# Altium schematic sheet STM32.SchDoc
size A4
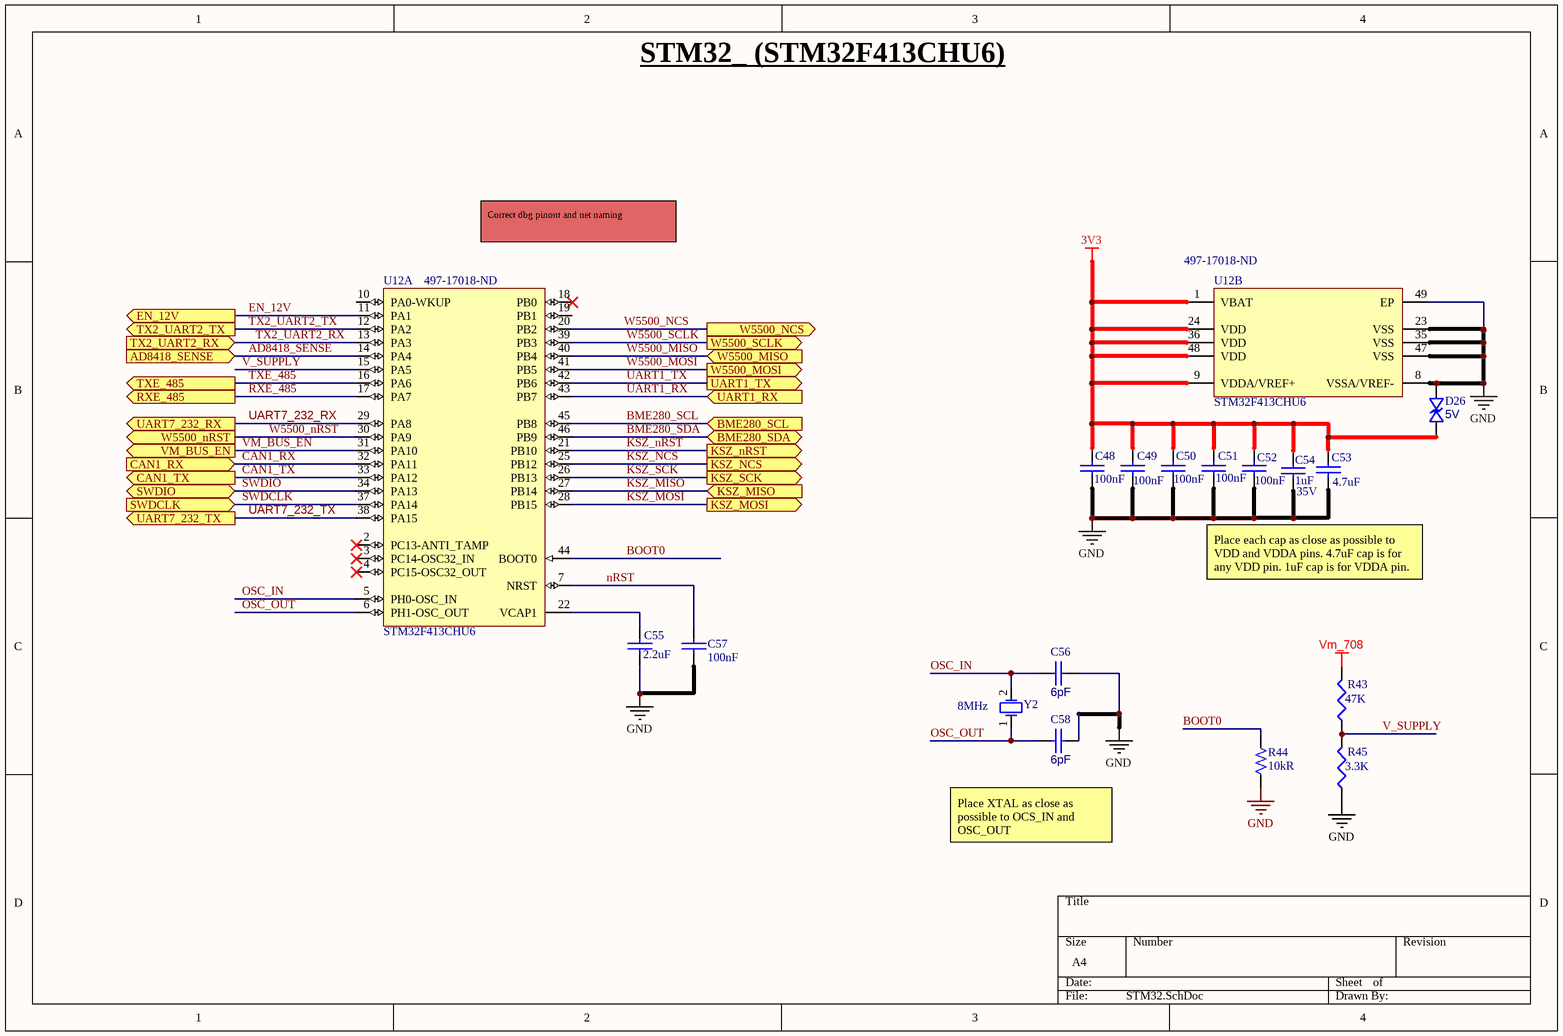
[diagram p0: STM32.SchDoc]

## Parts
C48  Capacitance: 100nF  [CAP0402]  (hidden comment: Capacitor)
C49  Capacitance: 100nF  [CAP0402]  (hidden comment: Capacitor)
C50  Capacitance: 100nF  [CAP0402]  (hidden comment: Capacitor)
C51  Capacitance: 100nF  [CAP0402]  (hidden comment: Capacitor)
C52  Capacitance: 100nF  [CAP0402]  (hidden comment: Capacitor)
C53  Capacitance: 4.7uF  [CAP0402]  (hidden comment: Capacitor)
C54  Voltage Rating: 35V  Capacitance: 1uF  [CAP0402]  (hidden comment: Capacitor)
C55  Capacitance: 2.2uF  [CAP0402]  (hidden comment: Capacitor)
C56  Capacitance: 6pF  [CAP0402]  (hidden comment: Capacitor)
C57  Capacitance: 100nF  [CAP0402]  (hidden comment: Capacitor)
C58  Capacitance: 6pF  [CAP0402]  (hidden comment: Capacitor)
D26  Reverse Standoff Voltage: 5V  [SLP1006P2T]  (hidden comment: TVS-Bidirectional)
R43  value 47K  [RES0402]  (hidden comment: Res)
R44  Resistance: 10kR  [RES0402]  (hidden comment: Resistor)
R45  value 3.3K  [RES0402]  (hidden comment: Res)
U12  STM32F413CHU6  Supplier Part Number 1: 497-17018-ND  [STM-UFQFPN48_M]  (parts A,B of 2)
Y2  value 8MHz  [2-SMD-XTAL (3.2x2.5)]  (hidden comment: Osc)

## Ports
AD8418_SENSE (in), BME280_SCL (in), BME280_SDA (bidir), CAN1_RX (in), CAN1_TX (out), EN_12V (out), KSZ_MISO (in), KSZ_MOSI (out), KSZ_NCS (out), KSZ_nRST (out), KSZ_SCK (out), RXE_485 (out), SWDCLK (in), SWDIO (bidir), TX2_UART2_RX (in), TX2_UART2_TX (out), TXE_485 (out), UART1_RX (in), UART1_TX (out), UART7_232_RX (out), UART7_232_TX (out), VM_BUS_EN (out), W5500_MISO (in), W5500_MOSI (out), W5500_NCS (out), W5500_nRST (out), W5500_SCLK (out)

## Nets
3V3: C48.1 C49.1 C50.1 C51.1 C52.1 C53.1 C54.2 D26.2 U12.1(VBAT) U12.9(VDDA/VREF+) U12.24(VDD) U12.36(VDD) U12.48(VDD)
GND: C48.2 C49.2 C50.2 C51.2 C52.2 C53.2 C54.1 C55.2 C56.1 C57.2 C58.1 D26.1 R44.2 R45.1 U12.8(VSSA/VREF-) U12.23(VSS) U12.35(VSS) U12.47(VSS) U12.49(EP)
Vm_708: R43.2
AD8418_SENSE: U12.14(PA4) ; port AD8418_SENSE
BME280_SCL: U12.45(PB8) ; port BME280_SCL
BME280_SDA: U12.46(PB9) ; port BME280_SDA
BOOT0: R44.1 U12.44(BOOT0)
CAN1_RX: U12.32(PA11) ; port CAN1_RX
CAN1_TX: U12.33(PA12) ; port CAN1_TX
EN_12V: U12.11(PA1) ; port EN_12V
KSZ_MISO: U12.27(PB14) ; port KSZ_MISO
KSZ_MOSI: U12.28(PB15) ; port KSZ_MOSI
KSZ_NCS: U12.25(PB12) ; port KSZ_NCS
KSZ_nRST: U12.21(PB10) ; port KSZ_nRST
KSZ_SCK: U12.26(PB13) ; port KSZ_SCK
nRST: C57.1 U12.7(NRST)
OSC_IN: C56.2 U12.5(PH0-OSC_IN) Y2.2
OSC_OUT: C58.2 U12.6(PH1-OSC_OUT) Y2.1
RXE_485: U12.17(PA7) ; port RXE_485
SWDCLK: U12.37(PA14) ; port SWDCLK
SWDIO: U12.34(PA13) ; port SWDIO
TX2_UART2_RX: U12.13(PA3) ; port TX2_UART2_RX
TX2_UART2_TX: U12.12(PA2) ; port TX2_UART2_TX
TXE_485: U12.16(PA6) ; port TXE_485
UART1_RX: U12.43(PB7) ; port UART1_RX
UART1_TX: U12.42(PB6) ; port UART1_TX
UART7_232_RX: U12.29(PA8) ; port UART7_232_RX
UART7_232_TX: U12.38(PA15) ; port UART7_232_TX
V_SUPPLY: R43.1 R45.2 U12.15(PA5)
VM_BUS_EN: U12.31(PA10) ; port VM_BUS_EN
W5500_MISO: U12.40(PB4) ; port W5500_MISO
W5500_MOSI: U12.41(PB5) ; port W5500_MOSI
W5500_NCS: U12.20(PB2) ; port W5500_NCS
W5500_nRST: U12.30(PA9) ; port W5500_nRST
W5500_SCLK: U12.39(PB3) ; port W5500_SCLK
NetC55_1: C55.1 U12.22(VCAP1)

Not connected (* = marked no-connect by the designer): U12 2(PC13-ANTI_TAMP)* 3(PC14-OSC32_IN)* 4(PC15-OSC32_OUT)* 10(PA0-WKUP) 18(PB0)* 19(PB1)

## Notes on the sheet
- STM32_ (STM32F413CHU6)
- Correct dbg pinout and net naming
- Place each cap as close as possible to VDD and VDDA pins. 4.7uF cap is for any VDD pin. 1uF cap is for VDDA pin.
- Place XTAL as close as possible to OCS_IN and OSC_OUT

## Library data of the parts
C48-C52 C57 = Capacitor: Manufacturer: TDK; Manufacturer Part Number: CGA2B3X7R1H104K050BB; Voltage Rating: 50V; Tolerance: 10%; Dielectric: X7R; Supplier 1: Digi-Key; Supplier Part Number 1: 445-6899-1-ND; Stock 1: 14098587; Mount: Surface Mount; Case/Package: 0402; Weight: 2.3E-05oz; Case Code (Metric): 1005; Case Code (Imperial): 0402; Min Operating Temperature: -55°C; Max Operating Temperature: 125°C; Packaging: Tape and Reel; Package Quantity: 1; Voltage Rating (DC): 50V; Termination: SMD/SMT; Composition: Ceramic; Voltage: 50V; Length: 1mm; Height: 0.5mm; Width: 0.02inch; Thickness: 0.022inch; Depth: 0.5mm; Ratings: AEC-Q200; REACH SVHC: No SVHC; Lead Free: Lead Free; ComponentLink1URL: http://product.tdk.com/capacitor/mlcc/en/documents/mlccspec_automotive_general_midvoltage_en.pdf?src-supplier=Future+Electronics; ComponentLink1Description: http://product.tdk.com/capacitor/mlcc/en/documents/mlccspec_automotive_general_midvoltage_en.pdf?src-supplier=Future+Electronics; ComponentLink2URL: http://www.farnell.com/datasheets/1807242.pdf?src-supplier=Element14; ComponentLink2Description: http://www.farnell.com/datasheets/1807242.pdf?src-supplier=Element14; ComponentLink3URL: http://www.mouser.com/ds/2/400/lcc_automotive_general_en-843974.pdf?src-supplier=Mouser; ComponentLink3Description: http://www.mouser.com/ds/2/400/lcc_automotive_general_en-843974.pdf?src-supplier=Mouser; ComponentLink4URL: http://www.farnell.com/datasheets/1936565.pdf?src-supplier=Element14; ComponentLink4Description: http://www.farnell.com/datasheets/1936565.pdf?src-supplier=Element14; ComponentLink5URL: http://www.farnell.com/datasheets/1735392.pdf?src-supplier=Element14; ComponentLink5Description: http://www.farnell.com/datasheets/1735392.pdf?src-supplier=Element14
C53 = Capacitor: Manufacturer 1: Samsung; Manufacturer Part Number 1: CL05A475MO5NUNC; Voltage Rating: 16V; Manufacturer: *; Manufacturer Part Number: *; Supplier: *; Supplier Part Number: *; Tolerance: *; Voltage: *; Footprint: *; Temperature Coefficient: *; Supplier 1: Digi-Key; Supplier Part Number 1: 1276-6836-1-ND; Stock 1: 2288634; Pricing 1: 1=0,41000, 10=0,29200, 100=0,19210, 500=0,14232, 1000=0,12097, 2500=0,11386, 5000=0,10674 (USD); RoHS: Yes; Mount: Surface Mount; Case/Package: 0402; Case Code (Metric): 1005; Case Code (Imperial): 0402; Min Operating Temperature: -55°C; Max Operating Temperature: 85°C; Packaging: Tape and Reel; Length: 0.039inch; Width: 0.02inch; Thickness: 0.022inch; ComponentLink1URL: http://www.samsungsem.com/kr/support/product-search/mlcc/CL05A475MO5NUNC.jsp?src-supplier=Digi-Key; ComponentLink1Description: http://www.samsungsem.com/kr/support/product-search/mlcc/CL05A475MO5NUNC.jsp?src-supplier=Digi-Key
C54 = Capacitor: Manufacturer 1: Murata; Manufacturer Part Number 1: GRM155R6YA105KE11D; Manufacturer: *; Manufacturer Part Number: *; Supplier: *; Supplier Part Number: *; Tolerance: *; Voltage: *; Footprint: *; Temperature Coefficient: *; Supplier 1: Digi-Key; Supplier Part Number 1: 490-10019-1-ND; Stock 1: 441965; Pricing 1: 1=0,26000, 10=0,18100, 100=0,10280, 500=0,07258, 1000=0,06350, 2500=0,06048, 5000=0,05594 (USD); RoHS: Yes; Mount: Surface Mount; Case/Package: 0402; Case Code (Imperial): 0402; Case Code (Metric): 1005; Min Operating Temperature: -55°C; Max Operating Temperature: 85°C; Packaging: Tape and Reel; Voltage Rating (DC): 35V; Length: 0.039inch; Width: 0.02inch; Thickness: 0.024inch; ComponentLink1URL: http://search.murata.co.jp/Ceramy/image/img/A01X/G101/ENG/GRM155R6YA105KE11-01.pdf?src-supplier=Digi-Key; ComponentLink1Description: http://search.murata.co.jp/Ceramy/image/img/A01X/G101/ENG/GRM155R6YA105KE11-01.pdf?src-supplier=Digi-Key; ComponentLink2URL: http://psearch.en.murata.com/capacitor/product/GRM155R6YA105KE11%23.pdf?src-supplier=Avnet; ComponentLink2Description: http://psearch.en.murata.com/capacitor/product/GRM155R6YA105KE11%23.pdf?src-supplier=Avnet
C55 = Capacitor: Manufacturer 1: Murata; Manufacturer Part Number 1: GRM155R61A225KE95D; Material: Ceramic; Dielectric: X5R; Voltage Rating (DC): 10V; Manufacturer: *; Manufacturer Part Number: *; Supplier: *; Supplier Part Number: *; Tolerance: *; Voltage: *; Footprint: *; Temperature Coefficient: *; Supplier 1: Digi-Key; Supplier Part Number 1: 490-10451-1-ND; Stock 1: 815357; Pricing 1: 1=0,11000, 10=0,08100, 100=0,03800, 500=0,02664, 1000=0,02205, 2500=0,02052, 5000=0,01878 (USD); RoHS: Yes; Mount: Surface Mount; Case/Package: 0402; Weight: 0.000212oz; Case Code (Metric): 1005; Case Code (Imperial): 0402; Min Operating Temperature: -55°C; Max Operating Temperature: 85°C; Termination: SMD/SMT; Package Quantity: 10000; Voltage Rating: 10V; Packaging: Tape and Reel; Length: 1mm; Height: 0.5mm; Thickness: 0.022inch; Depth: 0.5mm; Width: 0.5mm; REACH SVHC: No SVHC; Lead Free: Lead Free; ComponentLink1URL: http://www.mouser.com/ds/2/281/c02e-2905.pdf?src-supplier=Mouser; ComponentLink1Description: http://www.mouser.com/ds/2/281/c02e-2905.pdf?src-supplier=Mouser; ComponentLink2URL: http://components.arrow.com/part/dataview/0323_04264073?src-supplier=Arrow+Europe; ComponentLink2Description: http://components.arrow.com/part/dataview/0323_04264073?src-supplier=Arrow+Europe; ComponentLink3URL: http://www.farnell.com/datasheets/1872202.pdf?src-supplier=Farnell; ComponentLink3Description: http://www.farnell.com/datasheets/1872202.pdf?src-supplier=Farnell; ComponentLink4URL: http://www.farnell.com/datasheets/2047915.pdf?src-supplier=Farnell; ComponentLink4Description: http://www.farnell.com/datasheets/2047915.pdf?src-supplier=Farnell; ComponentLink5URL: http://www.farnell.com/datasheets/1872202.pdf?src-supplier=Element14; ComponentLink5Description: http://www.farnell.com/datasheets/1872202.pdf?src-supplier=Element14; ComponentLink6URL: https://search.murata.co.jp/Ceramy/image/img/A01X/G101/ENG/GRM155R61A225KE95-01.pdf?src-supplier=Digi-Key; ComponentLink6Description: https://search.murata.co.jp/Ceramy/image/img/A01X/G101/ENG/GRM155R61A225KE95-01.pdf?src-supplier=Digi-Key; ComponentLink7URL: http://www.farnell.com/datasheets/1872202.pdf?src-supplier=Newark; ComponentLink7Description: http://www.farnell.com/datasheets/1872202.pdf?src-supplier=Newark; ComponentLink8URL: http://psearch.en.murata.com/capacitor/product/GRM155R61A225KE95%23.pdf?src-supplier=Avnet; ComponentLink8Description: http://psearch.en.murata.com/capacitor/product/GRM155R61A225KE95%23.pdf?src-supplier=Avnet; ComponentLink9URL: http://www.farnell.com/datasheets/2047915.pdf?src-supplier=Element14; ComponentLink9Description: http://www.farnell.com/datasheets/2047915.pdf?src-supplier=Element14; ComponentLink10URL: http://www.farnell.com/datasheets/2047915.pdf?src-supplier=Newark; ComponentLink10Description: http://www.farnell.com/datasheets/2047915.pdf?src-supplier=Newark
C56 C58 = Capacitor: CAP CER 6PF 100V C0G/NP0 0402; Manufacturer 1: KEMET; Manufacturer Part Number 1: CBR04C609B1GAC; Manufacturer: *; Manufacturer Part Number: *; Supplier: *; Supplier Part Number: *; Tolerance: *; Voltage: *; Footprint: *; Temperature Coefficient: *; Supplier 1: Digi-Key; Supplier Part Number 1: 399-8610-1-ND; RoHS: Yes; Category: Ceramic Capacitors; Stock 1: 20446; Pricing 1: 1=0,34000, 10=0,23300, 50=0,15540, 100=0,13200, 500=0,09320, 1000=0,08154, 2500=0,07766, 5000=0,07184 (USD); Mount: Surface Mount; Case/Package: 0402; Case Code (Metric): 1005; Case Code (Imperial): 0402; Min Operating Temperature: -55°C; Max Operating Temperature: 125°C; Package Quantity: 1; Voltage Rating: 100V; Packaging: Tape and Reel; Voltage Rating (DC): 100V; Series: CBR; Length: 0.039inch; Width: 0.02inch; Thickness: 0.022inch; RoHS Compliant: Yes; ComponentLink1URL: https://datasheet.ciiva.com/6257/kem-c1030-cbr-smd-6257478.pdf?src-supplier=Digi-Key; ComponentLink1Description: https://datasheet.ciiva.com/6257/kem-c1030-cbr-smd-6257478.pdf?src-supplier=Digi-Key; ComponentLink2URL: https://datasheet.ciiva.com/6257/kem-c1030-cbr-smd-6257482.pdf?src-supplier=Digi-Key; ComponentLink2Description: https://datasheet.ciiva.com/6257/kem-c1030-cbr-smd-6257482.pdf?src-supplier=Digi-Key
D26 = TVS-Bidirectional: TVS DIODE 5V 20V SLP1006P2T; Manufacturer 1: Semtech; Manufacturer Part Number 1: RCLAMP0531TQTCT; Peak Pulse Current: 4A; Element Configuration: Single; Number of Bidirectional Channels: 1; Min Breakdown Voltage: 6V; Peak Pulse Power: 80W; Power Line Protection: No; Leakage Current: 100nA; Supplier 1: Digi-Key; Supplier Part Number 1: RCLAMP0531TQTCTCT-ND; RoHS: Yes; Category: TVS Diodes; Stock 1: 9000; Pricing 1: 1=1,09000, 10=0,97400, 100=0,69300, 500=0,58740, 1000=0,47850 (USD); Mount: Surface Mount; Case/Package: 0402; Number of Pins: 2; Case Code (Imperial): 0402; Case Code (Metric): 1006; Min Operating Temperature: -40°C; Max Operating Temperature: 125°C; Direction: Bidirectional; Packaging: Tape and Reel; Package Quantity: 3000; Resistor Type: Zener; Clamping Voltage: 20V; Working Voltage: 5V; Length: 1mm; Depth: 0.6mm; Radiation Hardening: No; Lead Free: Lead Free; ComponentLink1URL: https://datasheet.ciiva.com/26946/getdatasheetpartid-791156-26946873.pdf?src-supplier=Verical; ComponentLink1Description: https://datasheet.ciiva.com/26946/getdatasheetpartid-791156-26946873.pdf?src-supplier=Verical; ComponentLink2URL: https://datasheet.ciiva.com/29574/rclamp0531tq-29574060.pdf?src-supplier=Digi-Key; ComponentLink2Description: https://datasheet.ciiva.com/29574/rclamp0531tq-29574060.pdf?src-supplier=Digi-Key
R43 = Resistor: Manufacturer: Yageo; Manufacturer Part Number: RC0402JR-0747KL; Power Rating: 0.063W; Tolerance: 1%; Component Type: Resistor; Price: 0.15; Supplier: Digi-Key; Supplier Part Number: 311-47KJRCT-ND; Footprint: 0402 (1005 Metric)
R44 = Resistor: Manufacturer 1: Panasonic; Manufacturer Part Number 1: ERJ-2RKF1002X; Power Rating: 100mW; Tolerance: 1%; Voltage Rating: 50V; Temperature Coefficient: 100ppm/°C; Supplier 1: Digi-Key; Supplier Part Number 1: P10.0KLDKR-ND; Stock 1: 3290329; Pricing 1: 1=0,10000, 10=0,04100, 100=0,01680, 1000=0,00753, 2500=0,00653, 5000=0,00540 (USD); RoHS: Yes; Mount: Surface Mount; Case/Package: 0402; Number of Pins: 2; Contact Plating: Tin; Case Code (Metric): 1005; Case Code (Imperial): 0402; Min Operating Temperature: -55°C; Max Operating Temperature: 155°C; Packaging: Tape and Reel; Package Quantity: 1; Voltage Rating (DC): 50V; Features: Automotive AEC-Q200; Max Power Dissipation: 100mW; Composition: Thick Film; Number of Terminations: 2; Termination: SMD/SMT; Military Standard: Not; Length: 1mm; Height: 0.35mm; Width: 0.02inch; Depth: 0.5mm; Radiation Hardening: No; Lead Free: Lead Free; REACH SVHC: No SVHC; ComponentLink1URL: https://datasheet.ciiva.com/11821/0900766b80f80784-11821171.pdf?src-supplier=RSComponents; ComponentLink1Description: https://datasheet.ciiva.com/11821/0900766b80f80784-11821171.pdf?src-supplier=RSComponents; ComponentLink2URL: https://datasheet.ciiva.com/16199/aoa0000ce2-16199478.pdf?src-supplier=Future+Electronics; ComponentLink2Description: https://datasheet.ciiva.com/16199/aoa0000ce2-16199478.pdf?src-supplier=Future+Electronics; ComponentLink3URL: https://datasheet.ciiva.com/17212/aoa0000ce2-17212102.pdf?src-supplier=Avnet+Europe; ComponentLink3Description: https://datasheet.ciiva.com/17212/aoa0000ce2-17212102.pdf?src-supplier=Avnet+Europe; ComponentLink4URL: https://datasheet.ciiva.com/24023/aoa0000ce2-24023017.pdf?src-supplier=Mouser; ComponentLink4Description: https://datasheet.ciiva.com/24023/aoa0000ce2-24023017.pdf?src-supplier=Mouser; ComponentLink5URL: https://datasheet.ciiva.com/28514/1678782-28514185.pdf?src-supplier=Element14; ComponentLink5Description: https://datasheet.ciiva.com/28514/1678782-28514185.pdf?src-supplier=Element14; ComponentLink6URL: https://datasheet.ciiva.com/43467/1678782-43467402.pdf?src-supplier=Farnell; ComponentLink6Description: https://datasheet.ciiva.com/43467/1678782-43467402.pdf?src-supplier=Farnell; ComponentLink7URL: https://datasheet.ciiva.com/27055/1987020-27055643.pdf?src-supplier=Jameco; ComponentLink7Description: https://datasheet.ciiva.com/27055/1987020-27055643.pdf?src-supplier=Jameco; ComponentLink8URL: https://datasheet.ciiva.com/48531/aoa0000ce2-48531069.pdf?src-supplier=Avnet; ComponentLink8Description: https://datasheet.ciiva.com/48531/aoa0000ce2-48531069.pdf?src-supplier=Avnet; ComponentLink9URL: https://datasheet.ciiva.com/9194/aoa0000ce2-9194142.pdf?src-supplier=Avnet; ComponentLink9Description: https://datasheet.ciiva.com/9194/aoa0000ce2-9194142.pdf?src-supplier=Avnet; ComponentLink10URL: https://datasheet.ciiva.com/16782/70260748-16782590.pdf?src-supplier=Allied+Electronics; ComponentLink10Description: https://datasheet.ciiva.com/16782/70260748-16782590.pdf?src-supplier=Allied+Electronics; ComponentLink11URL: https://datasheet.ciiva.com/16786/70260748-16786734.pdf?src-supplier=Allied+Electronics; ComponentLink11Description: https://datasheet.ciiva.com/16786/70260748-16786734.pdf?src-supplier=Allied+Electronics; ComponentLink12URL: https://datasheet.ciiva.com/30201/aoa0000ce2-30201022.pdf?src-supplier=Onlinecomponents.com; ComponentLink12Description: https://datasheet.ciiva.com/30201/aoa0000ce2-30201022.pdf?src-supplier=Onlinecomponents.com
R45 = Resistor: Manufacturer: Yageo; Manufacturer Part Number: RC0402FR-073K3L; Power Rating: 0.063W; Tolerance: 1%; Component Type: Resistor; Price: 0.14; Supplier: Digikey; Supplier Part Number: 311-3.30KLRCT-ND
U12 = STM32F413CHU: ARM Cortex-M4 32-bit MCU+FPU, 105 DMIPS, 128 kB Flash, 64 kB Internal RAM, 36 I/Os, 48-pin UFQFPN, -40 to 85 degC, Tray; Manufacturer: STMicroelectronics; Interface: I2C,USB,IrDA,MMC,SDIO,UART,USART; Peripherals: Brown-out Detect/Reset,POR,PWM,WDT,DMA,LCD; Frequency: 100MHz; Number of I/Os: 36; Memory Size: 1.5MB; Component Type: 'ARM® Cortex®-M4, 32Bit, 100mhz, 48-UFQFPN (7x7); Manufacturer Part Number: STM32F413CHU6; Supplier 1: Digi-Key; Stock 1: 2911; Case/Package: UFQFPN; Min Operating Temperature: -40°C; Max Operating Temperature: 85°C; Memory Type: FLASH; Packaging: Tray; Core Architecture: ARM; Oscillator Type: Internal
Y2 = Crystal Oscillator: Manufacturer: NDK; Manufacturer Part Number: NX3225GD-8MHZ-STD-CRA-3; Component Type: Crystal Oscillator; Price: 0.94; Supplier: Digi-Key; Supplier Part Number: 644-1178-1-ND